# EasyEDA Pro project 单相逆变离并网和整流拓扑.eprj, schematic Schematic1
Board Name: 前级半桥; Create Date: 2026-03-26; Page Name: P1; Project Name: 单相逆变离并网和整流拓扑; Schematic Name: Schematic1; Update Date: 2026-03-26; Company: 嘉立创EDA; Page Size: A4; Version: V1.0
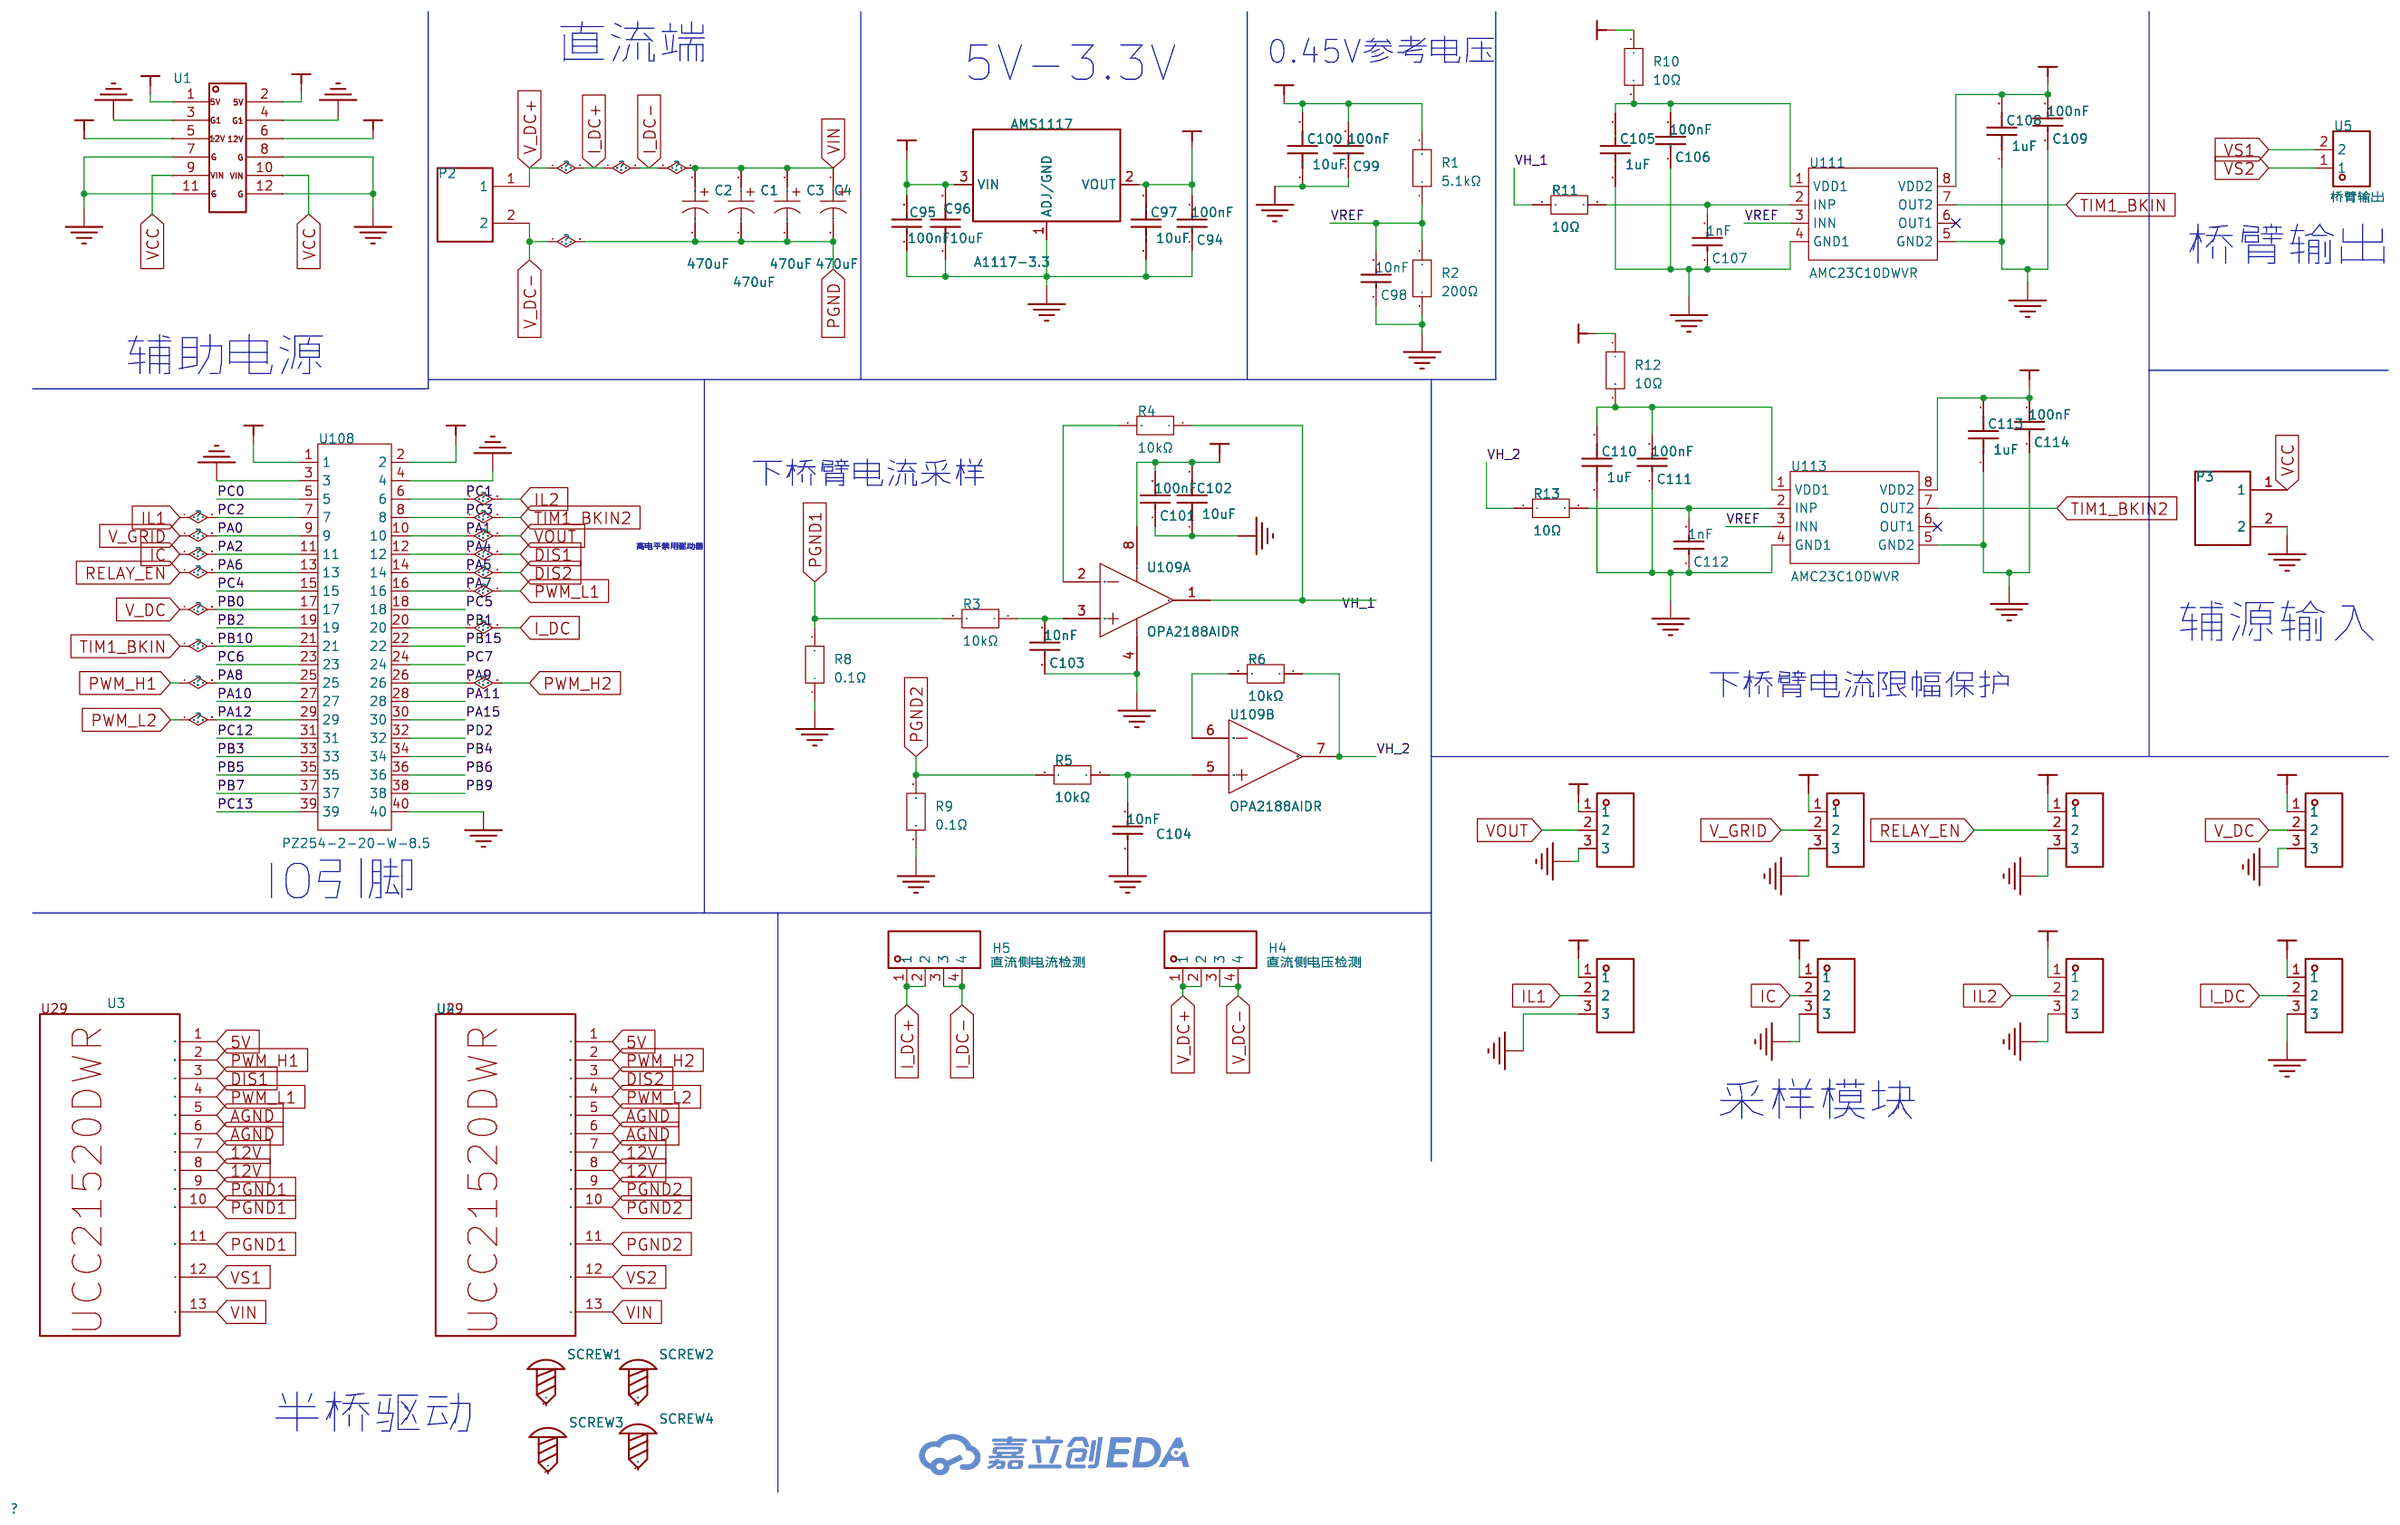
[diagram p0: schematic sheet]

## Parts
5VADC1GND1  WAFER-XH2.54-3PZZ  [CONN-TH_3P-P2.50_WAFER-XH2.54-3PZZ]
5VADC2GND1  WAFER-XH2.54-3PZZ  [CONN-TH_3P-P2.50_WAFER-XH2.54-3PZZ]
5VADC3GND1  WAFER-XH2.54-3PZZ  [CONN-TH_3P-P2.50_WAFER-XH2.54-3PZZ]
5VADC3GND2  WAFER-XH2.54-3PZZ  [CONN-TH_3P-P2.50_WAFER-XH2.54-3PZZ]
5VADC4GND1  WAFER-XH2.54-3PZZ  [CONN-TH_3P-P2.50_WAFER-XH2.54-3PZZ]
5VADC4GND2  WAFER-XH2.54-3PZZ  [CONN-TH_3P-P2.50_WAFER-XH2.54-3PZZ]
5VADC6GND1  WAFER-XH2.54-3PZZ  [CONN-TH_3P-P2.50_WAFER-XH2.54-3PZZ]
5VADC7GND1  WAFER-XH2.54-3PZZ  [CONN-TH_3P-P2.50_WAFER-XH2.54-3PZZ]
AMS1117  A1117-3.3  [SOT-223-3_L6.5-W3.4-P2.30-LS7.0-BR-1]
C1  470uF  [CAP-TH_BD16.0-P7.50-D0.8-FD]
C2  470uF  [CAP-TH_BD16.0-P7.50-D0.8-FD]
C3  470uF  [CAP-TH_BD16.0-P7.50-D0.8-FD]
C4  470uF  [CAP-TH_BD16.0-P7.50-D0.8-FD]
C94  100nF  [电容（0603）]
C95  100nF  [电容（0603）]
C96  10uF  [C0603]
C97  10uF  [C0603]
C98  10nF  [电容（0603）]
C99  100nF  [电容（0603）]
C100  10uF  [C0603]
C101  100nF  [电容（0603）]
C102  10uF  [C0603]
C103  10nF  [电容（0603）]
C104  10nF  [电容（0603）]
C105  1uF  [C0603]
C106  100nF  [电容（0603）]
C107  1nF  [电容（0603）]
C108  1uF  [C0603]
C109  100nF  [电容（0603）]
C110  1uF  [C0603]
C111  100nF  [电容（0603）]
C112  1nF  [电容（0603）]
C113  1uF  [C0603]
C114  100nF  [电容（0603）]
H4  直流侧电压检测  [HDR-TH_4P-P2.54-V-F]
H5  直流侧电流检测  [HDR-TH_4P-P2.54-V-F]
P2  WJ128V-5.0-2P  [CONN-TH_2P-P5.00_WJ128V-5.0-2P]
P3  WJ128V-5.0-2P  [CONN-TH_2P-P5.00_WJ128V-5.0-2P]
R1  5.1kΩ  [R0603]
R2  200Ω  [R0603]
R3  10kΩ  [R0603]
R4  10kΩ  [R0603]
R5  10kΩ  [R0603]
R6  10kΩ  [R0603]
R8  0.1Ω  [R2512]
R9  0.1Ω  [R2512]
R10  10Ω  [R0603]
R11  10Ω  [R0603]
R12  10Ω  [R0603]
R13  10Ω  [R0603]
SCREW1  -  [M3螺丝]
SCREW2  -  [M3螺丝]
SCREW3  -  [M3螺丝]
SCREW4  -  [M3螺丝]
U1  -  [辅助电源板卡-60-12-5]
U3  -  [UCC21520DWR直插封装]
U4  -  [UCC21520DWR直插封装]
U5  桥臂输出  [CONN-TH_2P-P7.62_L15.2-W16.7-EX4.2]
U108  PZ254-2-20-W-8.5  [HDR-TH_40P-P2.54-H-M-R2-C20-S2.54-W12.9-N]
U109  OPA2188AIDR  [SOIC-8_L4.9-W3.9-P1.27-LS6.0-BL]  (sections 1,2)
U111  AMC23C10DWVR  [SOIC-8_L7.5-W5.9-P1.27-LS11.5-BL]
U113  AMC23C10DWVR  [SOIC-8_L7.5-W5.9-P1.27-LS11.5-BL]

## Library data of the parts
5VADC1GND1 5VADC2GND1 5VADC3GND1 5VADC3GND2 5VADC4GND1 5VADC4GND2 5VADC6GND1 5VADC7GND1 = WAFER-XH2.54-3PZZ: 插针结构:1x3P;间距:2.54mm;安装方式:直插;总PIN数:3P;排数:1;每排PIN数:3;额定电流:2A;工作温度范围:-25℃~+85℃;; LCSC Part Name: XH 2.54mm 1x3P 直插; Supplier Part: C5374805; Manufacturer: XUNPU(讯普); Supplier Footprint: 插件,P=2.5mm; JLCPCB Part Class: 扩展库; Supplier: LCSC; Pins Structure: 1x3P; Pitch: 2.54mm; Mounting Style: 直插; Number of Pins: 3P; Number of Rows: 1; Number of PINs Per Row: 3; Current Rating (Max): 2A; Operating Temperature Range: -25℃~+85℃
AMS1117 = A1117-3.3: LCSC Part Name: AMS1117-3.3; Supplier Part: C7432020; Manufacturer: IDCHIP(英锐芯); Supplier Footprint: SOT-223; JLCPCB Part Class: 扩展库; Datasheet: https://atta.szlcsc.com/upload/public/pdf/source/20230625/435FEEFA02C0FE449E7397A11F8448E0.pdf; Supplier: LCSC; MAX Output Current: 1A; Feature: 过流保护；过热保护
C1-C4 = ERG100V470M16X26: 容值:470uF;精度:±20%;额定电压:100V;纹波电流:1.62A@100kHz;; LCSC Part Name: 470uF ±20% 100V; Supplier Part: C49256827; Manufacturer: JIERR(捷而瑞); Supplier Footprint: 插件,D16xL26mm; JLCPCB Part Class: 扩展库; Datasheet: https://item.szlcsc.com/datasheet/ERG100V470M16X26/51692227.html; Supplier: LCSC; Tolerance: ±20%; Voltage Rating: 100V; Ripple Current: 1.62A@100kHz; Pin Spacing: 7.5mm; Diameter: 16mm; Height - Seated (Max): 26mm; Lifetime: 2000hrs@105℃; Operating Temperature: -40℃~+105℃
C94 C95 C98 C99 C101 C103 C104 C106 C107 C109 C111 C112 C114 = 0805B104K500NT: LCSC Part Name: 100nF ±10% 50V; Supplier Part: C38141; Manufacturer: FH(风华); Supplier Footprint: 0805; JLCPCB Part Class: Extended Part; Datasheet: https://atta.szlcsc.com/upload/public/pdf/source/20200305/C486355_26A10D38EF8C2A5C37091D0039909270.pdf; Supplier: LCSC; Tolerance: ±10%; Voltage Rated: 50V; Temperature Coefficient: X7R
C96 C97 C100 C102 C105 C108 C110 C113 = GRM21BR61H106KE43L: LCSC Part Name: 10uF ±10% 50V; Supplier Part: C440198; Manufacturer: muRata(村田); Supplier Footprint: 0805; JLCPCB Part Class: 基础库; Datasheet: https://atta.szlcsc.com/upload/public/pdf/source/20230811/95AAE0C9AF55EDC31B7A4D8B733F534E.pdf; Supplier: LCSC; Tolerance: ±10%; Voltage Rated: 50V; Temperature Coefficient: X5R
H4 H5 = 2.54-1*4P母: 插孔结构:1x4P;间距:2.54mm;行距:-;圆孔/方孔:方孔;安装类型:直插;排数:单排;总孔位数:4P;额定电流:3A;额定电压:-;插孔方向:顶部;塑高:-;触头材质:青铜;触头镀层:-;工作温度范围:-40℃~+105℃;焊接温度(最大值):-;; LCSC Part Name: 间距:2.54mm 1x4P 直插; Supplier Part: C2718488; Manufacturer: BOOMELE(博穆精密); Supplier Footprint: 插件,P=2.54mm; Datasheet: https://atta.szlcsc.com/upload/public/pdf/source/20210301/C2718488_F4427B881E42CAA8DDB0B1C12B3A522C.pdf; Supplier: LCSC; Holes Structure: 1x4P; Pitch: 2.54mm; Circular Hole / Square Hole: 方孔; Mounting Type: 直插; Number of Rows: 单排; Number of Holes: 4P; Current Rating (Max): 3A; Holes Direction: 顶部; Contact Material: 青铜; Operating Temperature Range: -40℃~+105℃
P2 P3 = WJ128V-5.0-2P: 结构:1x2P;间距:5mm;颜色:绿色;安装方式:直插;额定电流:20A;额定电压:250V;排数:1;线规 - AWG:12~22;线规 - 平方毫米:2.5;每排PIN数:2;工作温度范围:-40℃~+105℃;; LCSC Part Name: 5mm 1x2P 排数:1 每排P数:2 直插; Supplier Part: C8269; Manufacturer: KANGNEX(康奈克斯电气); Supplier Footprint: 插件,P=5mm; JLCPCB Part Class: 扩展库; Datasheet: https://atta.szlcsc.com/upload/public/pdf/source/20191225/C8269_1FF44D6D2E83DB14A7CA266A410FD9AD.pdf; Supplier: LCSC; Structure: 1x2P; Pitch: 5mm; Color: 绿色; Mounting Style: 直插; Current Rating (Max): 20A; Voltage Rating (Max): 250V; Number of Pins: 2P; Number of Rows: 1; Wire Gauge - AWG: 12~22; Wire Gauge - mm2: 2.5; Number of PINs Per Row: 2; Operating Temperature Range: -40℃~+105℃
R1-R6 R10-R13 = RT0603DRD07110KL: 电阻类型:薄膜电阻;阻值:110kΩ;精度:±0.5%;功率:100mW;工作电压:75V;温度系数:±25ppm/℃;; LCSC Part Name: 薄膜电阻 110kΩ ±0.5% 100mW; Supplier Part: C728610; Manufacturer: YAGEO(国巨); Supplier Footprint: 0603; JLCPCB Part Class: 扩展库; Datasheet: https://item.szlcsc.com/datasheet/RT0603DRD07110KL/775925.html; Supplier: LCSC; Type: 薄膜电阻; Tolerance: ±0.5%; Power(Watts): 100mW; Voltage-Supply(Max): 75V; Temperature Coefficient: ±25ppm/℃; Operating Temperature: -55℃~+155℃
R8 R9 = FRC2512F7501TS: 电阻类型:厚膜电阻;阻值:7.5kΩ;精度:±1%;功率:1W;工作电压:200V;温度系数:±100ppm/℃;; LCSC Part Name: 7.5kΩ ±1% 1W 厚膜电阻; Supplier Part: C5154004; Manufacturer: FOJAN(富捷); Supplier Footprint: 2512; JLCPCB Part Class: 扩展库; Datasheet: https://item.szlcsc.com/datasheet/FRC2512F7501TS/5781132.html; Supplier: LCSC; Type: 厚膜电阻; Tolerance: ±1%; Power(Watts): 1W; Voltage-Supply(Max): 200V; Temperature Coefficient: ±100ppm/℃; Operating Temperature: -55℃~+155℃
SCREW1-SCREW4 = M3螺丝: Supplier Footprint: 插件
U1 = 辅助电源板卡-60-12-5
U3 U4 = UCC21520半桥驱动板
U5 = DBT50G-7.62-2P-BK-P: 隔板类型:带盖板;间距:7.62mm;结构:1x2P;安装方式:直针;引脚位置:边脚;排数:1;额定电流:20A;额定电压:300V;线规 - AWG:12~22;线规 - 平方毫米:-;工作温度范围:-40℃~+105℃;颜色:黑色;每排PIN数:2;; LCSC Part Name: 7.62mm 1x2P 每排P数:2 排数:1 直针 边脚; Supplier Part: C496127; Manufacturer: DORABO(地博电气); Supplier Footprint: 插件,P=7.62mm; JLCPCB Part Class: 扩展库; Datasheet: https://atta.szlcsc.com/upload/public/pdf/source/20230321/5EF6A0D07A73B1490602C5D26A4C0507.pdf; Supplier: LCSC; Barrier Type: 带盖板; Pitch: 7.62mm; Structure: 1x2P; Mounting Style: 直针; Pin Location: 边脚; Number of Pins: 2P; Number of Rows: 1; Current Rating (Max): 20A; Voltage Rating (Max): 300V; Wire Gauge - AWG: 12~22; Operating Temperature Range: -40℃~+105℃; Color: 黑色; Number of PINs Per Row: 2
U108 = PZ254-2-20-W-8.5: 插针结构:2x20P;间距:2.54mm;行距:2.54mm;圆针/方针:方针;安装方式:弯插;排数:双排;总PIN位数:40P;额定电流:3A;额定电压:-;配合针长度:6mm;塑高:2.5mm;端接针长度:-;触头材质:黄铜;工作温度:-40℃~+105℃;颜色:黑色;; LCSC Part Name: 2x20P 间距:2.54mm 方针 弯插; Supplier Part: C3012279; Manufacturer: HCTL(华灿天禄); Supplier Footprint: 弯插,P=2.54mm; JLCPCB Part Class: 扩展库; Datasheet: https://atta.szlcsc.com/upload/public/pdf/source/20230609/1B60364E488FD8696AA7206A46578DEA.pdf; Supplier: LCSC; Pin Structure: 2x20P; Pitch: 2.54mm; Row Spacing: 2.54mm; Circluar Pins/Square Pins: 方针; Mounting Type: 弯插; Number of Rows: 双排; Number of Pins: 40P; Current Rating: 3A; Length of Mating Pin: 6mm; Insulation Height: 2.5mm; Contact Material: 黄铜; Operating Temperature: -40℃~+105℃; Color: 黑色
U109 = OPA2188AIDR: 放大器数:双路;增益带宽积(GBP):2MHz;输入偏置电流(Ib):160pA;输入失调电压(Vos):6uV;压摆率(SR):0.8V/us;轨到轨:轨到轨输出;; LCSC Part Name: OPA2188AIDR  零漂移; Supplier Part: C17271; Manufacturer: TI(德州仪器); Supplier Footprint: SOIC-8; JLCPCB Part Class: 扩展库; Datasheet: https://www.ti.com/cn/lit/gpn/opa2188; Supplier: LCSC; Number of Channels: 双路; Gain Bandwidth Product: 2MHz; Ib - Input Bias Current: 160pA; Vos - Input Offset Voltage: 6uV; Common Mode Rejection Ratio(CMRR): 146dB; Slew Rate: 0.8V/us; Output Current: 18mA; Rail to Rail: 轨到轨输出; Quiescent Current(Iq): 475uA; Operating Temperature: -40℃~+105℃; Single Supply: 4V~36V; Dual Supply: -18V~-2V；2V~18V; Maximum Power Supply Range (Vdd-Vss): 36V; Noise density(eN): 8.8nV/√Hz@1kHz; Input Offset Current(Ios): 320pA
U111 U113 = AMC23C10DWVR: AMC23C10 具有开漏输出和推挽输出的快速响应、增强型隔离式差分比较器; LCSC Part Name: AMC23C10 快速响应、增强型隔离双比较器; Supplier Part: C5943166; Manufacturer: TI(德州仪器); Supplier Footprint: SOIC-8; JLCPCB Part Class: 扩展库; Datasheet: https://item.szlcsc.com/datasheet/AMC23C10DWVR/6880842.html; Supplier: LCSC; Number of Channels: 单路; Rail to Rail: -；-；-; Output Type: 开漏；推挽; Isolation Voltage(Vrms): 5000; Features: 上电确定；滞回可配置；失效安全; Voltage - Supply(Input): 3V~27V; Voltage - Supply(Output): 2.7V~5.5V

## Nets
3V3: 5VADC4GND1.1 5VADC4GND2.1 5VADC6GND1.1 5VADC7GND1.1 AMS1117.2(VOUT) C94.2 C97.2
5V: 5VADC1GND1.1 5VADC2GND1.1 5VADC3GND1.1 5VADC3GND2.1 AMS1117.3(VIN) C95.2 C96.2 C108.2 C109.2 C113.2 C114.2 U1.1 U1.2 U3.1(5V+) U4.1(5V+) U108.1 U108.2 U111.8(VDD2) U113.8(VDD2)
12V: C99.2 C100.2 C101.2 C102.2 R1.2 R10.1 R12.1 U1.5 U1.6 U3.7(12V) U3.8(12V) U4.7(12V) U4.8(12V) U109.8(V+)
AGND: 5VADC1GND1.3 5VADC2GND1.3 5VADC3GND1.3 5VADC3GND2.3 5VADC4GND1.3 5VADC4GND2.3 5VADC6GND1.3 5VADC7GND1.3 AMS1117.1(ADJ/GND) C94.1 C95.1 C96.1 C97.1 C108.1 C109.1 C113.1 C114.1 U1.3 U1.4 U3.5(GND) U3.6(GND) U4.5(GND) U4.6(GND) U108.3 U108.4 U108.40 U111.5(GND2) U113.5(GND2)
PGND: C1.2 C2.2 C3.2 C4.2 C98.1 C99.1 C100.1 C101.1 C102.1 C103.1 C104.1 C105.1 C106.1 C107.1 C110.1 C111.1 C112.1 H4.3 H4.4 P2.2 P3.2 R2.1 R8.1 R9.1 U1.7 U1.8 U1.11 U1.12 U109.4(V-) U111.4(GND1) U113.4(GND1)
PGND1: R3.2 R8.2 U3.9(PGND) U3.10(PGND) U3.11(PGND)
PGND2: R5.2 R9.2 U4.9(PGND) U4.10(PGND) U4.11(PGND)
VCC: P3.1 U1.9 U1.10
DIS1: U3.3(DIS) U108.12
DIS2: U4.3(DIS) U108.14
I_DC: 5VADC4GND2.2 U108.20
I_DC+: C1.1 C2.1 C3.1 C4.1 H4.1 H4.2 H5.1 H5.2 H5.3 H5.4 P2.1 U3.13(VIN) U4.13(VIN)
IC: 5VADC7GND1.2 U108.11
IL1: 5VADC6GND1.2 U108.7
IL2: 5VADC4GND1.2 U108.6
PA0: 5VADC2GND1.2 U108.9
PA1: 5VADC1GND1.2 U108.10
PA6: 5VADC3GND1.2 U108.13
PA7: U3.4(PWM_L) U108.16
PA8: U3.2(PWM_H) U108.25
PA9: U4.2(PWM_H) U108.26
PA10: U108.27
PA11: U108.28
PA12: U4.4(PWM_L) U108.29
PA15: U108.30
PB0: 5VADC3GND2.2 U108.17
PB2: U108.19
PB3: U108.33
PB4: U108.34
PB5: U108.35
PB6: U108.36
PB7: U108.37
PB9: U108.38
PB10: U108.21 U111.7(OUT2)
PB15: U108.22
PC0: U108.5
PC3: U108.8 U113.7(OUT2)
PC4: U108.15
PC5: U108.18
PC6: U108.23
PC7: U108.24
PC12: U108.31
PC13: U108.39
PD2: U108.32
VH_1: R4.1 R11.1 U109.1(OUT A)
VH_2: R6.1 R13.1 U109.7(OUT B)
VREF: C98.2 R1.1 R2.2 U111.3(INN) U113.3(INN)
VS1: U3.12(VS) U5.2
VS2: U4.12(VS) U5.1
$1N3465: C103.2 R3.1 U109.3(IN A+)
$1N3512: R4.2 U109.2(IN A-)
$1N3800: C104.2 R5.1 U109.5(IN B+)
$1N3825: R6.2 U109.6(IN B-)
$1N4645: C105.2 C106.2 R10.2 U111.1(VDD1)
$1N4750: C107.2 R11.2 U111.2(INP)
$1N5405: C112.2 R13.2 U113.2(INP)
$1N5409: C110.2 C111.2 R12.2 U113.1(VDD1)

Not connected (* = marked no-connect by the designer): SCREW1 1; SCREW2 1; SCREW3 1; SCREW4 1; U111 6(OUT1)*; U113 6(OUT1)*

## Notes on the sheet
- 直流端
- 5V-3.3V
- 0.45V参考电压
- 桥臂输出
- 辅助电源
- 下桥臂电流采样
- 高电平禁用驱动器
- 辅源输入
- 下桥臂电流限幅保护
- IO引脚
- 采样模块
- 半桥驱动
